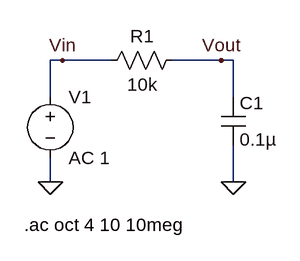
[diagram p0: schematic Simple LP.asc]
Simple LP.asc, the LTspice schematic file:
Version 4
SHEET 1 880 680
WIRE 112 128 96 128
WIRE 176 128 112 128
WIRE 320 128 256 128
WIRE 336 128 320 128
WIRE 96 176 96 128
WIRE 336 176 336 128
WIRE 96 288 96 256
WIRE 336 288 336 240
FLAG 336 288 0
FLAG 96 288 0
FLAG 112 128 Vin
FLAG 320 128 Vout
SYMBOL res 160 144 R270
WINDOW 0 32 56 VTop 2
WINDOW 3 0 56 VBottom 2
SYMATTR InstName R1
SYMATTR Value 10k
SYMBOL cap 320 176 R0
SYMATTR InstName C1
SYMATTR Value 0.1µ
SYMBOL voltage 96 160 R0
WINDOW 123 0 0 Left 2
WINDOW 39 0 0 Left 2
SYMATTR InstName V1
SYMATTR Value AC 1
TEXT 62 344 Left 2 !.ac oct 4 10 10meg

The netlist it stands for:
* Simple LP.asc
R1 Vin Vout 10k
C1 Vout 0 0.1µ
V1 Vin 0 AC 1
.ac oct 4 10 10meg
.backanno
.end